# Altium schematic sheet Hammerhead - MAX11300 Breakout Connectors R1.1.SchDoc
size B; SheetNumber: 4
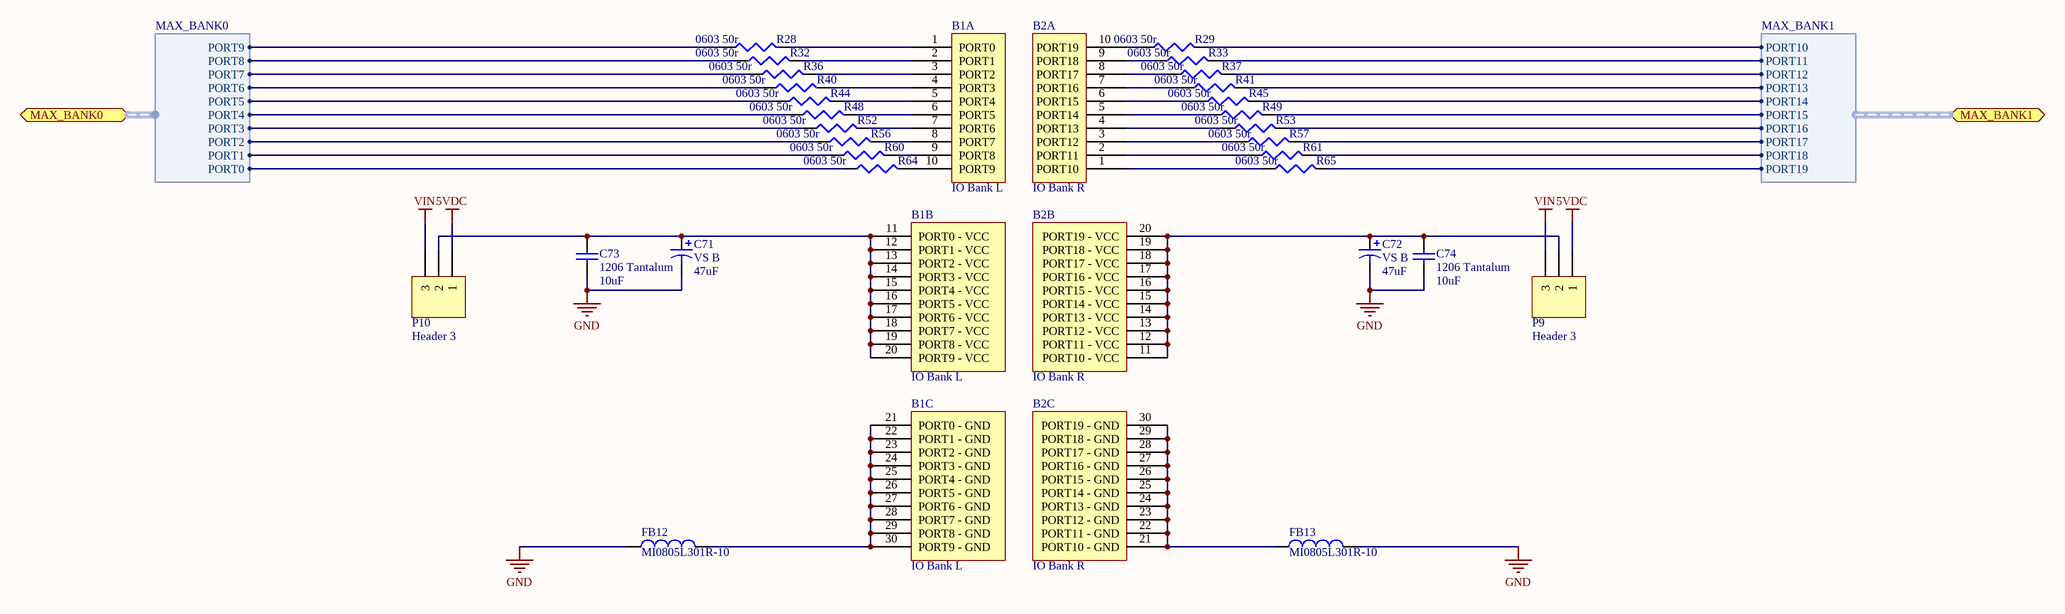
[diagram p0: Hammerhead - MAX11300 Breakout Connectors R1.1.SchDoc]

## Parts
B1  IO Bank L  [2.54mm 10X3 Header]  (parts A,B,C of 3)
B2  IO Bank R  [2.54mm 10X3 Header]  (parts A,B,C of 3)
C71  VS B  value 47uF  [Panasonic VS B]
C72  VS B  value 47uF  [Panasonic VS B]
C73  1206 Tantalum  value 10uF  [C1206]
C74  1206 Tantalum  value 10uF  [C1206]
FB12  MI0805L301R-10  [SM 0805 - gap trimmed]
FB13  MI0805L301R-10  [SM 0805 - gap trimmed]
P9  Header 3  [HDR1X3]
P10  Header 3  [HDR1X3]
R28  0603  value 50r  [J1-0603]
R29  0603  value 50r  [J1-0603]
R32  0603  value 50r  [J1-0603]
R33  0603  value 50r  [J1-0603]
R36  0603  value 50r  [J1-0603]
R37  0603  value 50r  [J1-0603]
R40  0603  value 50r  [J1-0603]
R41  0603  value 50r  [J1-0603]
R44  0603  value 50r  [J1-0603]
R45  0603  value 50r  [J1-0603]
R48  0603  value 50r  [J1-0603]
R49  0603  value 50r  [J1-0603]
R52  0603  value 50r  [J1-0603]
R53  0603  value 50r  [J1-0603]
R56  0603  value 50r  [J1-0603]
R57  0603  value 50r  [J1-0603]
R60  0603  value 50r  [J1-0603]
R61  0603  value 50r  [J1-0603]
R64  0603  value 50r  [J1-0603]
R65  0603  value 50r  [J1-0603]

## Ports
MAX_BANK0 (harness MAX_BANK0), MAX_BANK1 (harness MAX_BANK1)

## Harnesses
MAX_BANK1: PORT19, PORT18, PORT17, PORT16, PORT15, PORT14, PORT13, PORT12, PORT11, PORT10
MAX_BANK0: PORT0, PORT1, PORT2, PORT3, PORT4, PORT5, PORT6, PORT7, PORT8, PORT9

## Nets
5VDC: P9.1 P10.1
GND: C71.2 C72.2 C73.1 C74.1 FB12.1 FB13.2
VIN: P9.3 P10.3
NetB1_1: B1.1(PORT0) R28.2
NetB1_2: B1.2(PORT1) R32.2
NetB1_3: B1.3(PORT2) R36.2
NetB1_4: B1.4(PORT3) R40.2
NetB1_5: B1.5(PORT4) R44.2
NetB1_6: B1.6(PORT5) R48.2
NetB1_7: B1.7(PORT6) R52.2
NetB1_8: B1.8(PORT7) R56.2
NetB1_9: B1.9(PORT8) R60.2
NetB1_10: B1.10(PORT9) R64.2
NetB1_11: B1.11(PORT0_-_VCC) B1.12(PORT1_-_VCC) B1.13(PORT2_-_VCC) B1.14(PORT3_-_VCC) B1.15(PORT4_-_VCC) B1.16(PORT5_-_VCC) B1.17(PORT6_-_VCC) B1.18(PORT7_-_VCC) B1.19(PORT8_-_VCC) B1.20(PORT9_-_VCC) C71.1 C73.2 P10.2
NetB1_21: B1.21(PORT0_-_GND) B1.22(PORT1_-_GND) B1.23(PORT2_-_GND) B1.24(PORT3_-_GND) B1.25(PORT4_-_GND) B1.26(PORT5_-_GND) B1.27(PORT6_-_GND) B1.28(PORT7_-_GND) B1.29(PORT8_-_GND) B1.30(PORT9_-_GND) FB12.2
NetB2_1: B2.1(PORT10) R65.1
NetB2_2: B2.2(PORT11) R61.1
NetB2_3: B2.3(PORT12) R57.1
NetB2_4: B2.4(PORT13) R53.1
NetB2_5: B2.5(PORT14) R49.1
NetB2_6: B2.6(PORT15) R45.1
NetB2_7: B2.7(PORT16) R41.1
NetB2_8: B2.8(PORT17) R37.1
NetB2_9: B2.9(PORT18) R33.1
NetB2_10: B2.10(PORT19) R29.1
NetB2_11: B2.11(PORT10_-_VCC) B2.12(PORT11_-_VCC) B2.13(PORT12_-_VCC) B2.14(PORT13_-_VCC) B2.15(PORT14_-_VCC) B2.16(PORT15_-_VCC) B2.17(PORT16_-_VCC) B2.18(PORT17_-_VCC) B2.19(PORT18_-_VCC) B2.20(PORT19_-_VCC) C72.1 C74.2 P9.2
NetB2_21: B2.21(PORT10_-_GND) B2.22(PORT11_-_GND) B2.23(PORT12_-_GND) B2.24(PORT13_-_GND) B2.25(PORT14_-_GND) B2.26(PORT15_-_GND) B2.27(PORT16_-_GND) B2.28(PORT17_-_GND) B2.29(PORT18_-_GND) B2.30(PORT19_-_GND) FB13.1
NetR28_1: R28.1 ; port MAX_BANK0.PORT9
NetR29_2: R29.2 ; port MAX_BANK1.PORT10
NetR32_1: R32.1 ; port MAX_BANK0.PORT8
NetR33_2: R33.2 ; port MAX_BANK1.PORT11
NetR36_1: R36.1 ; port MAX_BANK0.PORT7
NetR37_2: R37.2 ; port MAX_BANK1.PORT12
NetR40_1: R40.1 ; port MAX_BANK0.PORT6
NetR41_2: R41.2 ; port MAX_BANK1.PORT13
NetR44_1: R44.1 ; port MAX_BANK0.PORT5
NetR45_2: R45.2 ; port MAX_BANK1.PORT14
NetR48_1: R48.1 ; port MAX_BANK0.PORT4
NetR49_2: R49.2 ; port MAX_BANK1.PORT15
NetR52_1: R52.1 ; port MAX_BANK0.PORT3
NetR53_2: R53.2 ; port MAX_BANK1.PORT16
NetR56_1: R56.1 ; port MAX_BANK0.PORT2
NetR57_2: R57.2 ; port MAX_BANK1.PORT17
NetR60_1: R60.1 ; port MAX_BANK0.PORT1
NetR61_2: R61.2 ; port MAX_BANK1.PORT18
NetR64_1: R64.1 ; port MAX_BANK0.PORT0
NetR65_2: R65.2 ; port MAX_BANK1.PORT19

## Library data of the parts
C71 C72 = Cap Pol1: Polarized Capacitor (Radial); Published: 8-Jun-2000; LatestRevisionDate: 17-Jul-2002; LatestRevisionNote: Re-released for DXP Platform.; PackageReference: RB7.6-15; Publisher: Altium Limited; PackageDescription: Polarized Capacitor (Radial); 2 Leads
C73 C74 = Cap Semi: Capacitor (Semiconductor SIM Model); Published: 8-Jun-2000; LatestRevisionDate: 29-May-2009; LatestRevisionNote: IPC-7351 Footprint Added.; PackageReference: C1206; Publisher: Altium Limited; PackageDescription: Chip Capacitor
FB12 FB13 = Inductor: Code_IEC: 1005; Published: 8-Jun-2000; LatestRevisionDate: 17-Jul-2002; LatestRevisionNote: Re-released for DXP Platform.; PackageReference: 0402-A; Publisher: Altium Limited; Code_JEITA: 0402
P9 P10 = Header 3: Header, 3-Pin; LatestRevisionDate: 17-Jul-2002; LatestRevisionNote: Re-released for DXP Platform.; Publisher: Altium Limited
R28 R29 R32 R33 R36 R37 R40 R41 R44 R45 R48 R49 R52 R53 R56 R57 R60 R61 R64 R65 = Res3: Resistor; Published: 8-Jun-2000; LatestRevisionDate: 29-May-2009; LatestRevisionNote: IPC-7351 Footprint Added.; PackageReference: J1-0603; Publisher: Altium Limited; PackageDescription: Chip Resistor